# Altium schematic sheet Receiver.SchDoc
size A; SheetNumber: 1; SheetTotal: 2
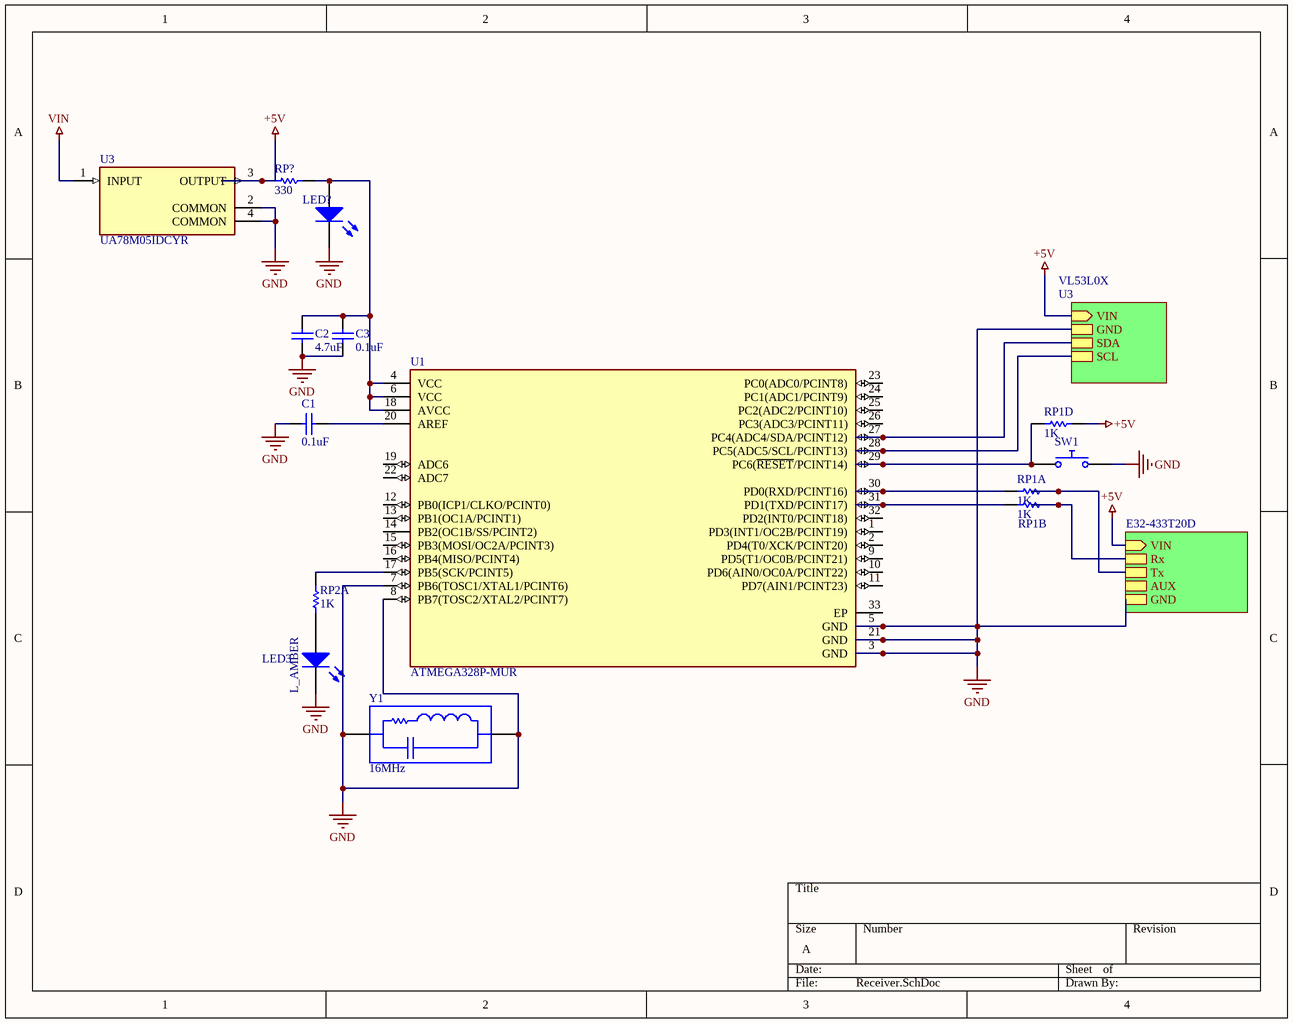
[diagram p0: Receiver.SchDoc]

## Parts
C1  value 0.1uF  (hidden comment: Capacitor)
C2  value 4.7uF  (hidden comment: Capacitor)
C3  value 0.1uF  (hidden comment: Capacitor)
LED3  L_AMBER
LED?  Light-Emitting Diode  (value not drawn)
RP1A  value 1K  (hidden comment: Resistor)
RP1B  value 1K  (hidden comment: Resistor)
RP1D  value 1K  (hidden comment: Resistor)
RP2A  value 1K  (hidden comment: Resistor)
RP?  value 330  (hidden comment: Resistor)
SW1  Push Button Normally Opened  (value not drawn)
U1  ATMEGA328P-MUR  [FP-32M1-A-IPC_A]
U3  UA78M05IDCYR  [FP-DCY0004A-MFG]
Y1  16MHz

## Sub-sheets
r = E32-433T20D: Rx, Tx, GND, VIN (in), AUX
VL53L0X = U3: VIN (in), GND, SDA, SCL

## Nets
+5V: RP1D.2 RP?.1 U3.3(OUTPUT) ; sheet VL53L0X/VIN, sheet r/VIN
GND: C1.1 C2.1 C3.1 LED3.2(K) LED?.2(K) SW1.2 U1.3(GND) U1.5(GND) U1.7(PB6(TOSC1/XTAL1/PCINT6)) U1.8(PB7(TOSC2/XTAL2/PCINT7)) U1.21(GND) U3.2(COMMON) U3.4(COMMON) Y1.1 Y1.2 ; sheet VL53L0X/GND, sheet r/GND
VIN: U3.1(INPUT)
NetC1_2: C1.2 U1.20(AREF)
NetC2_2: C2.2 C3.2 LED?.1(A) RP?.2 U1.4(VCC) U1.6(VCC) U1.18(AVCC)
NetLED3_1: LED3.1(A) RP2A.1
NetRP1A_1: RP1A.1 U1.30(PD0(RXD/PCINT16))
NetRP1A_2: RP1A.2 ; sheet r/Tx
NetRP1B_1: RP1B.1 U1.31(PD1(TXD/PCINT17))
NetRP1B_2: RP1B.2 ; sheet r/Rx
NetRP1D_1: RP1D.1 SW1.1 U1.29(PC6(~{RESET}/PCINT14))
NetRP2A_2: RP2A.2 U1.17(PB5(SCK/PCINT5))
NetU1_27: U1.27(PC4(ADC4/SDA/PCINT12)) ; sheet VL53L0X/SDA
NetU1_28: U1.28(PC5(ADC5/SCL/PCINT13)) ; sheet VL53L0X/SCL

Not connected (* = marked no-connect by the designer): U1 1(PD3(INT1/OC2B/PCINT19)) 2(PD4(T0/XCK/PCINT20)) 9(PD5(T1/OC0B/PCINT21)) 10(PD6(AIN0/OC0A/PCINT22)) 11(PD7(AIN1/PCINT23)) 12(PB0(ICP1/CLKO/PCINT0)) 13(PB1(OC1A/PCINT1)) 14(PB2(OC1B/SS/PCINT2)) 15(PB3(MOSI/OC2A/PCINT3)) 16(PB4(MISO/PCINT4)) 19(ADC6) 22(ADC7) 23(PC0(ADC0/PCINT8)) 24(PC1(ADC1/PCINT9)) 25(PC2(ADC2/PCINT10)) 26(PC3(ADC3/PCINT11)) 32(PD2(INT0/PCINT18)) 33(EP)

## Library data of the parts
C1-C3 = Capacitor: SimulationGenericComponent: True
LED3 = LED: Light-Emitting Diode; AF: 1; BV: 0; BV_MAX: 1e99; EG: 1.11; FC: 0.5; IBV: 0.001; IS: 1e-14; MJSW: 0.33; NTUN: 30; TNOM: 27; XTI: 3; SimulationGenericComponent: True; CJO: 0; CJP: 0; CTA: 0; CTP: 0; FCS: 0.5; FV_MAX: 1e99; IKF: 0; IKR: 0; ISR: 1e-14; JSW: 0; JTUN: 0; JTUNSW: 0; KEG: 1; KF: 0; LEVEL: 1; N: 1; NBV: 1; NR: 1; NS: 1; PHP: 1; RS: 0; TCV: 0; TLEV: 0; TLEVC: 0; TM1: 0; TM2: 0; TPB: 0; TPHP: 0; TRS: 0; TRS2: 0; TT: 0; TTT1: 0; TTT2: 0; VJ: 1; XTITUN: 3
LED? = LED: AF: 1; BV: 0; BV_MAX: 1e99; EG: 1.11; FC: 0.5; IBV: 0.001; IS: 1e-14; MJSW: 0.33; NTUN: 30; TNOM: 27; XTI: 3; SimulationGenericComponent: True; CJO: 0; CJP: 0; CTA: 0; CTP: 0; FCS: 0.5; FV_MAX: 1e99; IKF: 0; IKR: 0; ISR: 1e-14; JSW: 0; JTUN: 0; JTUNSW: 0; KEG: 1; KF: 0; LEVEL: 1; N: 1; NBV: 1; NR: 1; NS: 1; PHP: 1; RS: 0; TCV: 0; TLEV: 0; TLEVC: 0; TM1: 0; TM2: 0; TPB: 0; TPHP: 0; TRS: 0; TRS2: 0; TT: 0; TTT1: 0; TTT2: 0; VJ: 1; XTITUN: 3
RP1A RP1B RP1D RP2A RP? = Resistor: TC1: 0; SimulationGenericComponent: True; TC2: 0
SW1 = Push Button NO: closed: 0; Rclosed: 1m; Ropen: 1Meg; SimulationGenericComponent: True
U1 = CMP-06276-000062-1: ADRUINO; Number of I/Os: 24; Core Architecture: PIC; Frequency: 20MHz; Memory Type: FLASH; Memory Size: 3.5KB; Interface: I2C; Peripherals: Brown-out Detect/Reset; Oscillator Type: Internal; Case/Package: VQFN; Min Operating Temperature: -40°C; Packaging: Rail/Tube; Max Operating Temperature: 125°C
U3 = CMP-04917-000030-1: +5V REG; Manufacturer: Texas Instruments; Min Supply Voltage: 7V; Number Of Outputs: 1; Dropout Voltage: 2V; Max Supply Voltage: 25V; Output Current: 500mA; Output Type: Fixed; Output Voltage: 5V; Max Junction Temp: +125°C; Standoff Height: 0.02mm; Automotive: No; Temperature Range Low: -40°C; Temperature Range High: +125°C; Package: DCY0004A; Lead Free: Yes; Octopart: https://octopart.com/ua78m05idcyr-texas+instruments-525575; ComponentLink2URL: http://www.ti.com/lit/ds/symlink/ua78m.pdf; Mouser Description: Linear Voltage Regulators 5V 500mA Fixed Pos Voltage Regulator; Device Class L1: Integrated Circuits (ICs); Device Class L3: Voltage Regulators - Linear; RoHS: TRUE; ComponentLink2Description: Datasheet; Height: 1.8mm; Temperature: -40°C to +125°C; Manufacturer Part Number: UA78M05IDCYR; Digikey Description: IC REG LINEAR 5V 500MA SOT223-4; Category: IC; Device Class L2: Power Management ICs; Ipc Land Pattern Name: SOT230P700X180-4
Y1 = Resonator: Lin: 1m; Q0: 20; SimulationGenericComponent: True; F0: 16MHz